# Altium project ClockBooster.PrjPCB
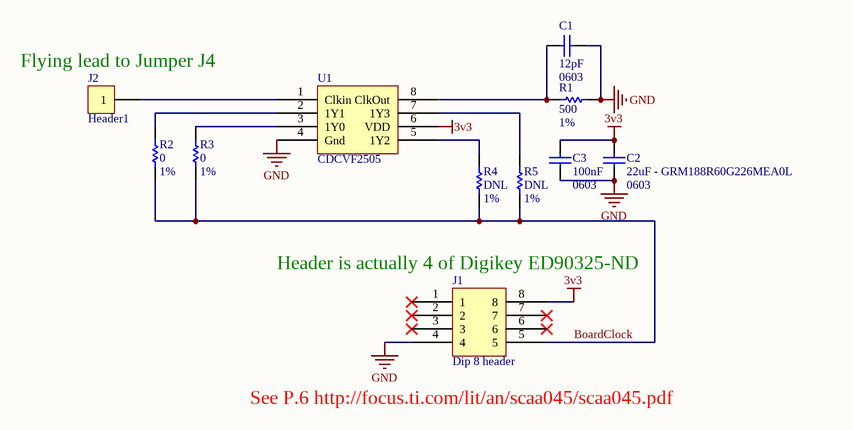
[diagram p0: ClockBooster.SchDoc]
1 sheet, 11 parts. Net scope: global (net labels, ports and power ports of the same name join across sheets).
Board files: ClockBooster.PcbDoc, ClockBoosterBoardArray.PcbDoc

## Sheet ClockBooster.SchDoc
size Letter

### Parts
C1  12pF  [0603]
C2  22uF - GRM188R60G226MEA0L  [0603]
C3  100nF  [0603]
J1  Dip 8 header  [DIP8Header]
J2  Header1  [HDR1]
R1  value 500  Param: 1%  [0603]  (hidden comment: Res0603)
R2  value 0  Param: 1%  [0603]  (hidden comment: Res0603)
R3  value 0  Param: 1%  [0603]  (hidden comment: Res0603)
R4  value DNL  Param: 1%  [0603]  (hidden comment: Res0603)
R5  value DNL  Param: 1%  [0603]  (hidden comment: Res0603)
U1  CDCVF2505  [SO8]

### Nets
3v3: C2.2 C3.2 J1.8 U1.6(VDD)
GND: C1.1 C2.1 C3.1 J1.4 R1.1 U1.4(Gnd)
BoardClock: J1.5 R2.1 R3.1 R4.1 R5.1
NetC1_2: C1.2 R1.2 U1.8(ClkOut)
NetJ2_1: J2.1 U1.1(Clkin)
NetR2_2: R2.2 U1.2(1Y1)
NetR3_2: R3.2 U1.3(1Y0)
NetR4_2: R4.2 U1.5(1Y2)
NetR5_2: R5.2 U1.7(1Y3)

Not connected (* = marked no-connect by the designer): J1 1* 2* 3* 6* 7*

### Notes on the sheet
- (near J2) Flying lead to Jumper J4
- (near J1) Header is actually 4 of Digikey ED90325-ND
- (near J1) See P.6 http://focus.ti.com/lit/an/scaa045/scaa045.pdf

### Library data of the parts
C1-C3 = Cap0603: Capacitor, Ceramic, 0603; TechInf: *; Param1: *
J1 = DIP8Header
J2 = Header1: TestPoint1; Footprint: *; Techinf: *
R1-R5 = Res0603: Resistor; Param1: 100ppm/C; TechInfo: *
U1 = CDCVF2505: PLL 24->200Mhz PLL